# Altium project WeatherStationSensors.PrjPCB
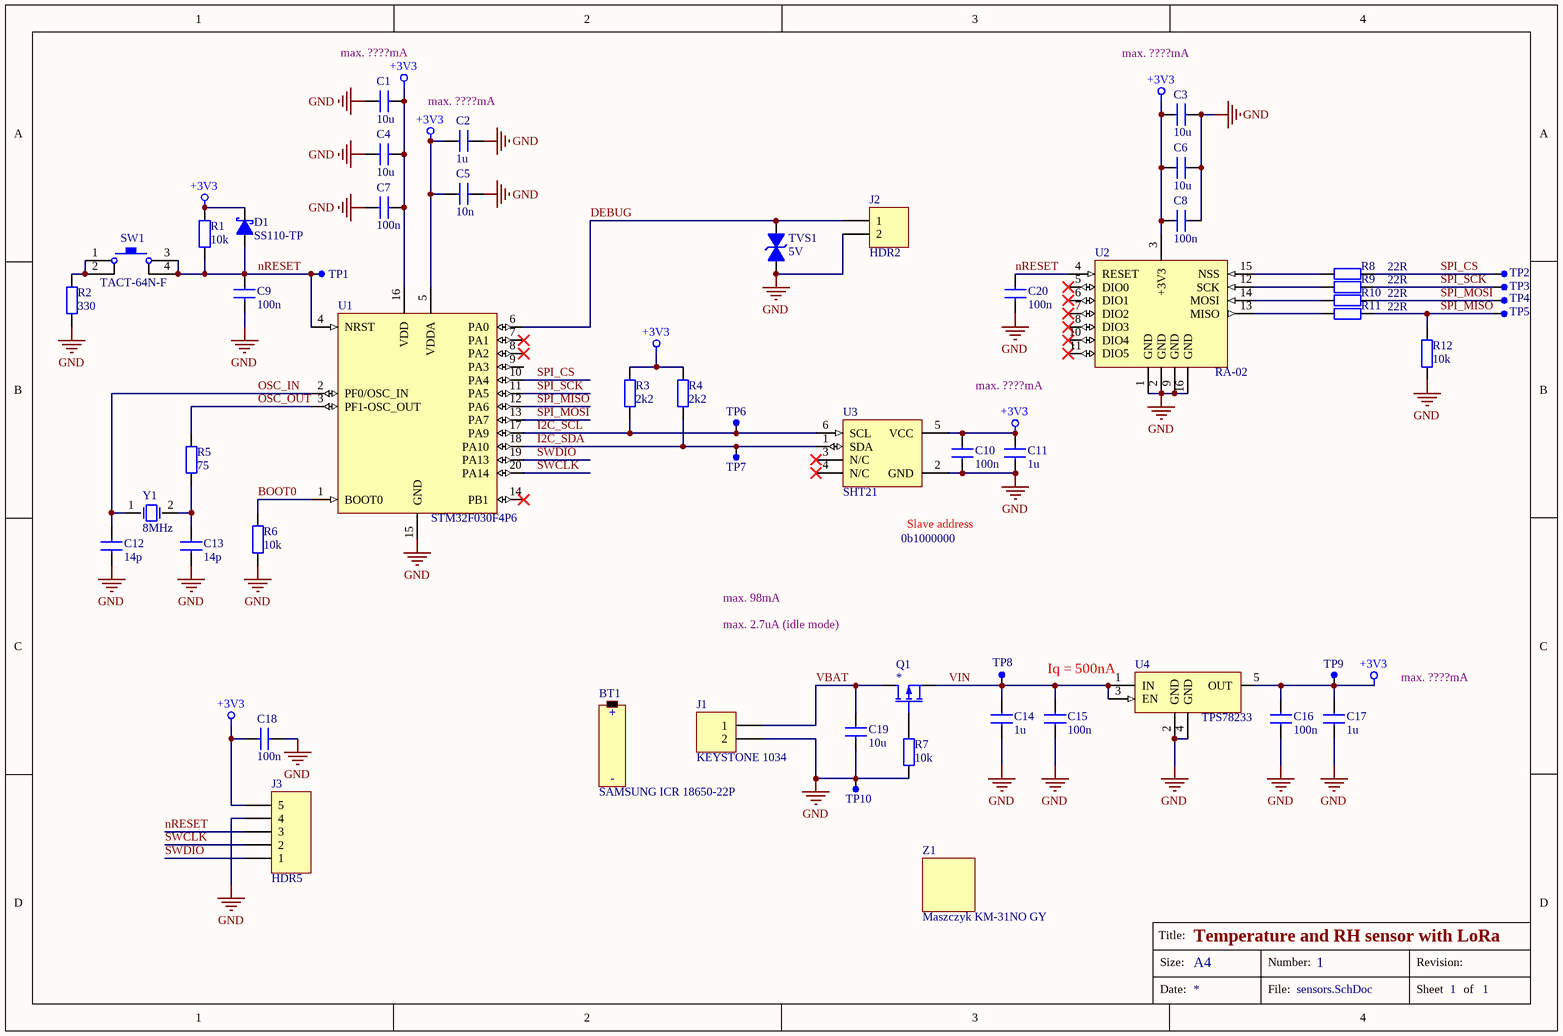
[diagram p0: sensors.SchDoc]
.revision: 1.0
1 sheet, 56 parts. Net scope: global (net labels, ports and power ports of the same name join across sheets).
Board file: PCB.PcbDoc

## Sheet sensors.SchDoc: Temperature and RH sensor with LoRa
size A4; DrawnBy: Damian Dolewski; Engineer: Damian Dolewski; DocumentNumber: 1; Revision: 1.0; SheetNumber: 1; SheetTotal: 1

### Parts
BT1  SAMSUNG ICR 18650-22P  [BATTERY_18650]
C1  value 10u  [C_0805]  (hidden comment: Capacitor)
C2  value 1u  [C_0805]  (hidden comment: Capacitor)
C3  value 10u  [C_0805]  (hidden comment: Capacitor)
C4  value 10u  [C_0805]  (hidden comment: Capacitor)
C5  value 10n  [C_0805]  (hidden comment: Capacitor)
C6  value 10u  [C_0805]  (hidden comment: Capacitor)
C7  value 100n  [C_0805]  (hidden comment: Capacitor)
C8  value 100n  [C_0805]  (hidden comment: Capacitor)
C9  value 100n  [C_0805]  (hidden comment: Capacitor)
C10  value 100n  [C_0805]  (hidden comment: Capacitor)
C11  value 1u  [C_0805]  (hidden comment: Capacitor)
C12  value 14p  [C_0805]  (hidden comment: Capacitor)
C13  value 14p  [C_0805]  (hidden comment: Capacitor)
C14  value 1u  [C_0805]  (hidden comment: Capacitor)
C15  value 100n  [C_0805]  (hidden comment: Capacitor)
C16  value 100n  [C_0805]  (hidden comment: Capacitor)
C17  value 1u  [C_0805]  (hidden comment: Capacitor)
C18  value 100n  [C_0805]  (hidden comment: Capacitor)
C19  value 10u  [C_0805]  (hidden comment: Capacitor)
C20  value 100n  [C_0805]  (hidden comment: Capacitor)
D1  SS110-TP  [D_1206]
J1  value KEYSTONE 1034  [KEYSTONE 1043]  (hidden comment: Header 2)
J2  value HDR2  [header 2.54mm 2pin]  (hidden comment: Header 2)
J3  value HDR5  [header 2.54mm 5pin]  (hidden comment: Header 5)
Q1  MOSFET-P  [SOT-23]  (value not drawn)
R1  value 10k  [R_0805]  (hidden comment: Resistor)
R2  value 330  [R_0805]  (hidden comment: Resistor)
R3  value 2k2  [R_0805]  (hidden comment: Resistor)
R4  value 2k2  [R_0805]  (hidden comment: Resistor)
R5  value 75  [R_0805]  (hidden comment: Resistor)
R6  value 10k  [R_0805]  (hidden comment: Resistor)
R7  value 10k  [R_0805]  (hidden comment: Resistor)
R8  value 22R  [R_0805]  (hidden comment: Resistor)
R9  value 22R  [R_0805]  (hidden comment: Resistor)
R10  value 22R  [R_0805]  (hidden comment: Resistor)
R11  value 22R  [R_0805]  (hidden comment: Resistor)
R12  value 10k  [R_1206]  (hidden comment: Resistor)
SW1  value TACT-64N-F  [SPST_NO_1301]  (hidden comment: Switch-PB 4 Pins)
TP1  TEST PAD  [PIN]  (value not drawn)
TP2  TEST PAD  [PIN]  (value not drawn)
TP3  TEST PAD  [PIN]  (value not drawn)
TP4  TEST PAD  [PIN]  (value not drawn)
TP5  TEST PAD  [PIN]  (value not drawn)
TP6  TEST PAD  [PIN]  (value not drawn)
TP7  TEST PAD  [PIN]  (value not drawn)
TP8  TEST PAD  [PIN]  (value not drawn)
TP9  TEST PAD  [PIN]  (value not drawn)
TP10  TEST PAD  [PIN]  (value not drawn)
TVS1  value 5V  [D_1206]  (hidden comment: SMAJ5.0ALFCT-ND)
U1  STM32F030F4P6  [TSSOP20]
U2  value RA-02  [RA-02]  (hidden comment: LoRa RA-02 SX1278 433MHz)
U3  SHT21  [DFN6]
U4  TPS78233  [SOP5(6)]
Y1  value 8MHz  [CFPX_217]  (hidden comment: 7A-8.000MAAE-T)
Z1  Maszczyk KM-31NO GY  [KM-31NO GY]

### Nets
+3V3: C1.1 C2.2 C3.2 C4.1 C5.2 C6.2 C7.1 C8.2 C10.2 C11.1 C16.2 C17.1 C18.2 D1.2(K) J3.5 R1.2 R3.2 R4.2 TP9.1 U1.5(VDDA) U1.16(VDD) U2.3(+3V3) U3.5(VCC) U4.5(OUT)
GND: C1.2 C2.1 C3.1 C4.2 C5.1 C6.1 C7.2 C8.1 C9.1 C10.1 C11.2 C12.1 C13.1 C14.2 C15.1 C16.1 C17.2 C18.1 C19.2 C20.1 J1.2 J2.2 J3.4 R2.1 R6.1 R7.1 R12.1 TP10.1 TVS1.1(A) U1.15(GND) U2.1(GND) U2.2(GND) U2.9(GND) U2.16(GND) U3.2(GND) U4.2(GND) U4.4(GND)
BOOT0: R6.2 U1.1(BOOT0)
DEBUG: J2.1 TVS1.2(K) U1.6(PA0)
I2C_SCL: R3.1 TP6.1 U1.17(PA9) U3.6(SCL)
I2C_SDA: R4.1 TP7.1 U1.18(PA10) U3.1(SDA)
nRESET: C9.2 C20.2 D1.1(A) J3.3 R1.1 SW1.3 SW1.4 TP1.1 U1.4(NRST) U2.4(RESET)
OSC_IN: C12.2 U1.2(PF0/OSC_IN) Y1.1(OSC1)
OSC_OUT: R5.2 U1.3(PF1-OSC_OUT)
SPI_CS: R8.1 TP2.1 U1.10(PA4)
SPI_MISO: R11.1 R12.2 TP5.1 U1.12(PA6)
SPI_MOSI: R10.1 TP4.1 U1.13(PA7)
SPI_SCK: R9.1 TP3.1 U1.11(PA5)
SWCLK: J3.2 U1.20(PA14)
SWDIO: J3.1 U1.19(PA13)
VBAT: C19.1 J1.1 Q1.3(D)
VIN: C14.1 C15.2 Q1.2(S) TP8.1 U4.1(IN) U4.3(EN)
NetC13_2: C13.2 R5.1 Y1.2(OSC2)
NetQ1_1: Q1.1(G) R7.2
NetR2_2: R2.2 SW1.1 SW1.2
NetR8_2: R8.2 U2.15(NSS)
NetR9_2: R9.2 U2.12(SCK)
NetR10_2: R10.2 U2.14(MOSI)
NetR11_2: R11.2 U2.13(MISO)

Not connected (* = marked no-connect by the designer): U1 7(PA1)* 8(PA2)* 9(PA3) 14(PB1)*; U2 5(DIO0)* 6(DIO1)* 7(DIO2)* 8(DIO3)* 10(DIO4)* 11(DIO5)*; U3 3(N/C)* 4(N/C)*

### Notes on the sheet
- (near C1) max. ????mA
- max. ????mA
- (near C3) max. ????mA
- 0b1000000
- (near U3) Slave address
- max. 98mA
- max. 2.7uA (idle mode)
- (near U4) Iq = 500nA
- Title:
- Size:
- A4
- Number:
- Revision:
- Date:
- File:
- Sheet
- of
- (in symbol Battery) +; -

### Library data of the parts
BT1 = Battery: Multicell Battery; Published: 24-Mar-1999; LatestRevisionDate: 17-Jul-2002; LatestRevisionNote: Re-released for DXP Platform.; PackageReference: BAT-2; Publisher: Altium Limited; PackageDescription: Battery; 2 Leads
D1 = Diode Schottky: Schottky Diode; Value: SS110-TP
J1 J2 = Header 2: Header, 2-Pin
J3 = Header 5: Header, 5-Pin
Q1 = MOSFET-P: P-Channel MOSFET; Value: *
SW1 = Switch-PB 4 Pins: Switch 4 Pins
TP1-TP10 = TEST_PAD: PAD 1.5mm
TVS1 = Transil
U1 = STM32F030F4P6: Mikrokontroler ARM; Flash:16kB; 48MHz; SRAM:4kB; TSSOP20
U2 = RA-02 SX1278
U3 = SHT21: Humidity and Temperature Sensor IC; Value: SHT21
U4 = TPS78233: 150-mA, ultra-low quiescent qurrent (500 nA) low-dropout linear regulator; Value: TPS78233
Y1 = XTAL: Crystal Oscillator
Z1 = KM-31NO GY: X:80mm; Y:114mm; Z:32mm; wentylowana; ABS